# EAGLE design ssm2167_micamp (EAGLE 7.7.0)
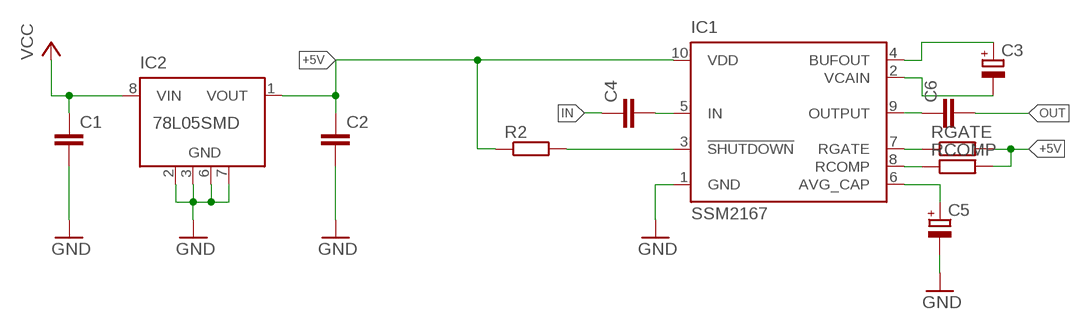
[diagram p0: schematic, sheet 1]

## Parts
C1  C-EUC0603K  [C0603K]
C2  C-EUC0603K  [C0603K]
C3  CPOL-EUE  [PANASONIC_E]
C4  C-EUC1812  [C1812]
C5  CPOL-EUE  [PANASONIC_E]
C6  C-EUC1812  [C1812]
IC1  SSM2167  [SO10]
IC2  78L05SMD  [SO08]
R2  R-EU_M1206  [M1206]
RCOMP  R-EU_M1206  [M1206]
RGATE  R-EU_M1206  [M1206]

## Nets
+5V: C2.1 IC1.10(VDD) IC2.1(VOUT) R2.1 RCOMP.2 RGATE.2
GND: C1.2 C2.2 C5.- IC1.1(GND) IC2.2(GND) IC2.3(GND) IC2.6(GND) IC2.7(GND)
IN: C4.1
N$1: IC1.3(!SHUTDOWN) R2.2
N$2: IC1.7(RGATE) RGATE.1
N$3: IC1.8(RCOMP) RCOMP.1
N$4: C3.+ IC1.4(BUFOUT)
N$5: C3.- IC1.2(VCAIN)
N$6: C4.2 IC1.5(IN)
N$7: C5.+ IC1.6(AVG_CAP)
N$8: C6.1 IC1.9(OUTPUT)
OUT: C6.2
VCC: C1.1 IC2.8(VIN)
Unconnected: IC2.4(NC) IC2.5(NC)

## Library data of the parts
C1 C2 C4 C6 = rcl:C-EU: CAPACITOR, European symbol
C3 C5 = rcl:CPOL-EU: POLARIZED CAPACITOR, European symbol
IC1 = analog-devices:SSM2167: Low Voltage Microphone Preamplifier with Variable Compression and Noise Gating Source: http://www.analog.com .. SSM2167.pdf; MPN: SSM2167Z-EVAL; OC_FARNELL: 1424672; OC_NEWARK: 65M4647
IC2 = linear:78L*SMD: Positive VOLTAGE REGULATOR
R2 RCOMP RGATE = rcl:R-EU_: RESISTOR, European symbol

## Board
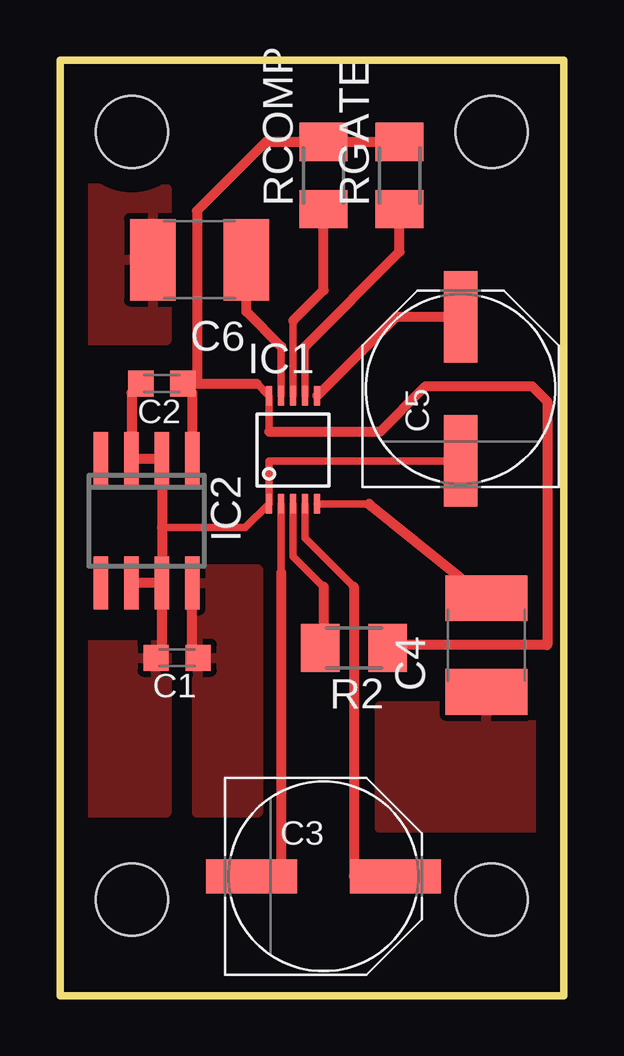
[diagram p1: board, top side]

Size 21 x 39 mm. Coordinates in mm from the lower left corner, seen from the top.
Outline: 0,0 0,39 21,39 21,0 0,0
Copper layers (1*16): Top 0.035mm / dielectric 1.5mm / Bottom 0.035mm
Design rules "default": minimum track width 10mil, minimum drill 24mil, track to track 8mil, track to pad 8mil, pad to pad 8mil, via to via 8mil, smd to smd 8mil, copper to edge 40mil, drill to drill 8mil, minimum pad ring 10mil, minimum via ring 8mil, stop-mask expansion 4mil, vias tented up to drill 0mil, thermal gap 10mil
Holes 3 mm at 18,4 3,36 18,36 3,4

### Footprints (pad centres in the part's own frame; a part is rotated, then mirrored left to right if it is on the bottom)
C0603K = smd 1.05 x 1.08: 1 -0.875,0; 2 0.875,0
PANASONIC_E = smd 3.8 x 1.4: + 3,0; - -3,0
C1812 = smd 1.9 x 3.4: 1 -1.95,0; 2 1.95,0
SO10 = smd 0.25 x 0.8: 1 -1,-2.25; 2 -0.5,-2.25; 3 0,-2.25; 4 0.5,-2.25; 5 1,-2.25; 6 1,2.25; 7 0.5,2.25; 8 0,2.25; 9 -0.5,2.25; 10 -1,2.25
SO08 = smd 0.6 x 2.2: 1 -1.905,-2.6; 2 -0.635,-2.6; 3 0.635,-2.6; 4 1.905,-2.6; 5 1.905,2.6; 6 0.635,2.6; 7 -0.635,2.6; 8 -1.905,2.6
M1206 = smd 1.6 x 2: 1 -1.4,0; 2 1.4,0

### Placement (x,y rotation side)
C1  4.88,14.08 180 top
C2  4.25,25.51 180 top
C3  10.99,4.97 0 top
C4  17.78,14.61 90 top
C5  16.7,25.29 90 top
C6  5.83,30.68 180 top
IC1  9.72,22.75 0 top
IC2  3.62,19.8 180 top
R2  12.26,14.49 180 top
RCOMP  10.99,34.18 90 top
RGATE  14.16,34.18 90 top

### Tracks (layer width: path | path; a pad name or v marks a point on that pad's centre or on a via)
+5V
  Top 0.305: 8.21,25.51 IC1.10 8.72,23.5 | IC2.1 5.52,23.5 | 13.77,14.61 R2.1
  Top 0.406: RGATE.2 RCOMP.2 8.58,35.58 5.71,32.72 5.71,25.51 | IC2.1 5.52,25.11 C2.1 5.71,25.51 | 5.71,25.51 8.21,25.51 | 13.77,14.61 20.32,14.61 20.32,24.77 19.68,25.4 15.24,25.4 13.34,23.5 8.72,23.5
GND
  Top 0.305: 4.25,19.5 7.72,19.5 IC1.1 8.72,22.29 C5.-
  Top 0.406: C2.2 2.98,25.11 IC2.3 IC2.2 4.25,19.5 IC2.7 | IC2.7 IC2.6 | C1.2 4.25,14.32 IC2.7
  pour Top: 0.64,7.62 0.64,14.61 4.45,14.61 4.45,7.62
IN
  pour Top: 13.34,12.06 20.32,12.06 20.32,6.99 13.34,6.99
N$1
  Top 0.305: IC1.3 9.72,18.3 10.99,17.04 | 10.99,14.62 R2.2
  Top 0.406: 10.99,17.04 10.99,14.62
N$2
  Top 0.305: IC1.7 10.22,27.06
  Top 0.406: 10.22,27.06 14.16,31 RGATE.1
N$3
  Top 0.305: IC1.8 9.72,28.14
  Top 0.406: 9.72,28.14 10.79,29.21 10.99,29.41 RCOMP.1
N$4
  Top 0.305: IC1.4 10.22,19.07 12.26,17.04
  Top 0.406: 12.26,17.04 12.26,4.97 C3.+
N$5
  Top 0.305: IC1.2 9.22,17.63
  Top 0.406: 9.22,17.63 9.22,4.97 C3.-
N$6
  Top 0.305: IC1.5 12.89,20.5
  Top 0.406: 12.89,20.5 C4.2
N$7
  Top 0.406: C5.+ 14.01,28.29 IC1.6
N$8
  Top 0.305: IC1.9 9.22,27.06
  Top 0.406: 9.22,27.06 7.78,28.5 C6.1
OUT
  pour Top: 0.64,27.3 0.64,33.66 4.45,33.66 4.45,27.3
VCC
  Top 0.406: C1.1 5.52,14.32 IC2.8
  pour Top: 5.71,7.62 5.71,17.78 8.26,17.78 8.26,7.62